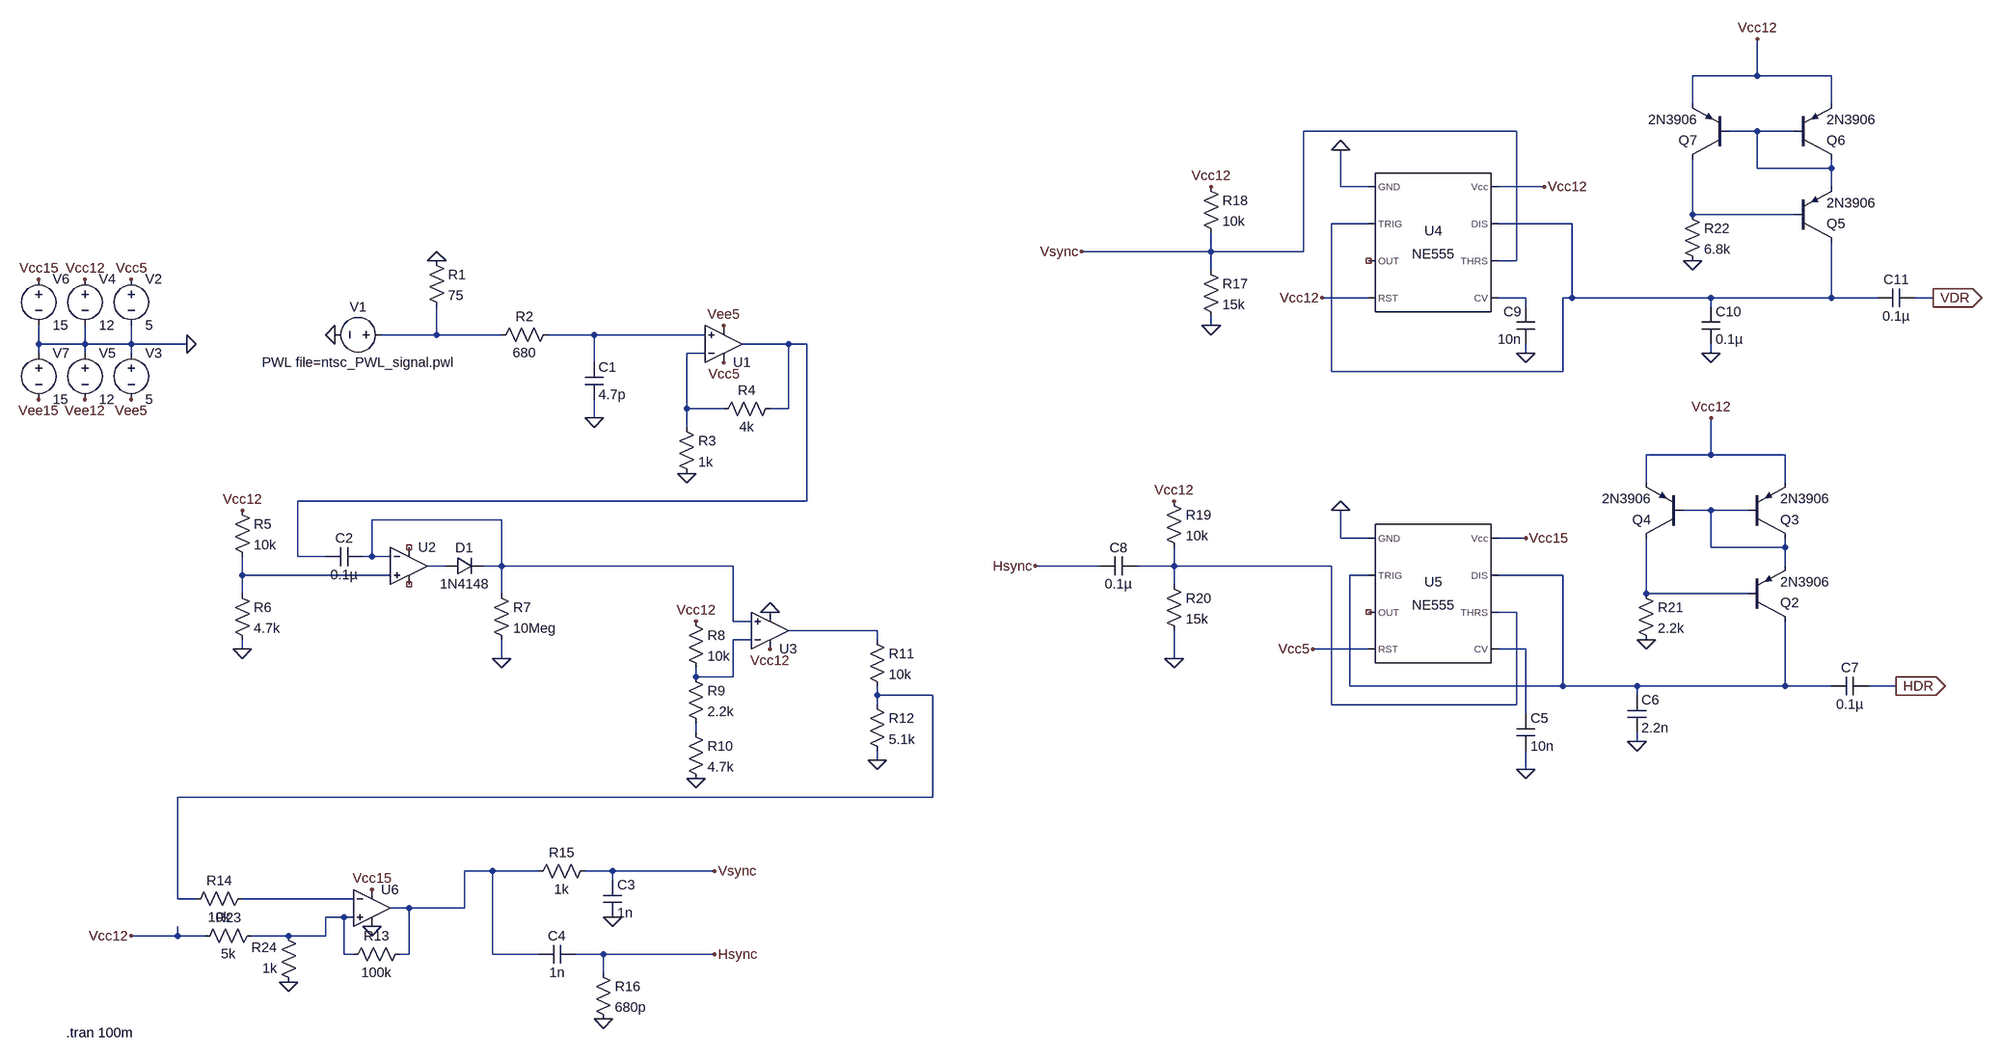
[diagram p0: schematic DocPlagueCir.asc]
DocPlagueCir.asc, the LTspice schematic file:
Version 4
SHEET 1 3116 1032
WIRE 2704 -640 2704 -704
WIRE 2704 -640 2592 -640
WIRE 2832 -640 2704 -640
WIRE 2592 -592 2592 -640
WIRE 2832 -592 2832 -640
WIRE 2288 -544 1920 -544
WIRE 2704 -544 2656 -544
WIRE 2768 -544 2704 -544
WIRE 2704 -480 2704 -544
WIRE 2832 -480 2832 -496
WIRE 2832 -480 2704 -480
WIRE 1984 -448 1984 -512
WIRE 2032 -448 1984 -448
WIRE 2336 -448 2256 -448
WIRE 2832 -448 2832 -480
WIRE 2592 -400 2592 -496
WIRE 2768 -400 2592 -400
WIRE 2032 -384 1968 -384
WIRE 2384 -384 2256 -384
WIRE 1760 -336 1760 -368
WIRE 1760 -336 1536 -336
WIRE 1920 -336 1920 -544
WIRE 1920 -336 1760 -336
WIRE 2288 -320 2288 -544
WIRE 2288 -320 2256 -320
WIRE 1760 -304 1760 -336
WIRE 2032 -256 1952 -256
WIRE 2304 -256 2256 -256
WIRE 2384 -256 2384 -384
WIRE 2384 -256 2368 -256
WIRE 2624 -256 2384 -256
WIRE 2832 -256 2832 -352
WIRE 2832 -256 2624 -256
WIRE 2912 -256 2832 -256
WIRE 3008 -256 2976 -256
WIRE 2304 -240 2304 -256
WIRE 2624 -240 2624 -256
WIRE 1760 -208 1760 -224
WIRE 160 -192 160 -240
WIRE 160 -192 64 -192
WIRE 272 -192 160 -192
WIRE 432 -192 352 -192
WIRE 624 -192 432 -192
WIRE -528 -176 -528 -208
WIRE -448 -176 -448 -208
WIRE -448 -176 -528 -176
WIRE -368 -176 -368 -208
WIRE -368 -176 -448 -176
WIRE -272 -176 -368 -176
WIRE 768 -176 688 -176
WIRE 800 -176 768 -176
WIRE -528 -160 -528 -176
WIRE -448 -160 -448 -176
WIRE -368 -160 -368 -176
WIRE 624 -160 592 -160
WIRE 2304 -160 2304 -176
WIRE 2624 -160 2624 -176
WIRE 432 -144 432 -192
WIRE 1968 -128 1968 -384
WIRE 2368 -128 2368 -256
WIRE 2368 -128 1968 -128
WIRE 592 -64 592 -160
WIRE 656 -64 592 -64
WIRE 768 -64 768 -176
WIRE 768 -64 736 -64
WIRE 432 -48 432 -80
WIRE 592 -32 592 -64
WIRE 2624 16 2624 -48
WIRE 2624 16 2512 16
WIRE 2752 16 2624 16
WIRE 2512 64 2512 16
WIRE 2752 64 2752 16
WIRE 800 96 800 -176
WIRE 800 96 -80 96
WIRE 2624 112 2576 112
WIRE 2688 112 2624 112
WIRE 272 128 48 128
WIRE 1984 160 1984 112
WIRE 2032 160 1984 160
WIRE 2304 160 2256 160
WIRE 2624 176 2624 112
WIRE 2752 176 2752 160
WIRE 2752 176 2624 176
WIRE -80 192 -80 96
WIRE -32 192 -80 192
WIRE 48 192 48 128
WIRE 48 192 32 192
WIRE 80 192 48 192
WIRE 176 208 144 208
WIRE 272 208 272 128
WIRE 272 208 240 208
WIRE 672 208 272 208
WIRE 1568 208 1456 208
WIRE 1696 208 1696 176
WIRE 1696 208 1632 208
WIRE 1968 208 1696 208
WIRE 2752 208 2752 176
WIRE -176 224 -176 192
WIRE 80 224 -176 224
WIRE 2032 224 2000 224
WIRE 2368 224 2256 224
WIRE 1696 240 1696 208
WIRE -176 256 -176 224
WIRE 272 256 272 208
WIRE 2512 256 2512 160
WIRE 2688 256 2512 256
WIRE 2288 288 2256 288
WIRE 672 304 672 208
WIRE 704 304 672 304
WIRE 928 320 768 320
WIRE 704 336 672 336
WIRE 928 336 928 320
WIRE -176 352 -176 336
WIRE 2032 352 1936 352
WIRE 2304 352 2256 352
WIRE 272 368 272 336
WIRE 1696 368 1696 320
WIRE 608 400 608 384
WIRE 672 400 672 336
WIRE 672 400 608 400
WIRE 2000 416 2000 224
WIRE 2368 416 2368 224
WIRE 2368 416 2000 416
WIRE 2496 416 2368 416
WIRE 2752 416 2752 304
WIRE 2752 416 2496 416
WIRE 2832 416 2752 416
WIRE 2944 416 2896 416
WIRE 928 432 928 416
WIRE 1024 432 928 432
WIRE 2496 432 2496 416
WIRE 928 448 928 432
WIRE 1968 448 1968 208
WIRE 2288 448 2288 288
WIRE 2288 448 1968 448
WIRE 2304 464 2304 352
WIRE 608 496 608 480
WIRE 2496 512 2496 496
WIRE 928 544 928 528
WIRE 2304 560 2304 528
WIRE 1024 608 1024 432
WIRE 1024 608 -288 608
WIRE 256 736 208 736
WIRE 336 736 256 736
WIRE 464 736 416 736
WIRE 640 736 464 736
WIRE 464 752 464 736
WIRE -288 784 -288 608
WIRE -256 784 -288 784
WIRE 16 784 -176 784
WIRE 112 800 80 800
WIRE 208 800 208 736
WIRE 208 800 112 800
WIRE 0 816 -32 816
WIRE 16 816 0 816
WIRE -288 848 -288 832
WIRE -288 848 -368 848
WIRE -240 848 -288 848
WIRE -96 848 -160 848
WIRE -32 848 -32 816
WIRE -32 848 -96 848
WIRE 0 880 0 816
WIRE 16 880 0 880
WIRE 112 880 112 800
WIRE 112 880 96 880
WIRE 256 880 256 736
WIRE 336 880 256 880
WIRE 448 880 400 880
WIRE 640 880 448 880
WIRE 448 912 448 880
FLAG -272 -176 0
FLAG -368 -80 Vee5
FLAG -368 -288 Vcc5
FLAG -16 -192 0
FLAG 160 -320 0
FLAG 432 -48 0
FLAG -448 -288 Vcc12
FLAG -448 -80 Vee12
FLAG 656 -208 Vee5
FLAG 656 -144 Vcc5
FLAG 592 48 0
FLAG -176 352 0
FLAG -176 112 Vcc12
FLAG 272 368 0
FLAG 736 288 0
FLAG 736 352 Vcc12
FLAG 608 304 Vcc12
FLAG 608 576 0
FLAG 928 544 0
FLAG 464 816 0
FLAG 640 736 Vsync
FLAG 448 992 0
FLAG 640 880 Hsync
FLAG 1760 -208 0
FLAG 1760 -448 Vcc12
FLAG 1696 96 Vcc12
FLAG 1696 368 0
FLAG 1984 112 0
FLAG -528 -288 Vcc15
FLAG -528 -80 Vee15
FLAG 2304 160 Vcc15
FLAG 1936 352 Vcc5
FLAG 2304 560 0
FLAG 2496 512 0
FLAG 2512 336 0
FLAG 2624 -48 Vcc12
FLAG 2944 416 HDR
IOPIN 2944 416 Out
FLAG 2336 -448 Vcc12
FLAG 1984 -512 0
FLAG 2304 -160 0
FLAG 1952 -256 Vcc12
FLAG 2592 -320 0
FLAG 2704 -704 Vcc12
FLAG 2624 -160 0
FLAG 3008 -256 VDR
IOPIN 3008 -256 Out
FLAG 48 832 0
FLAG 48 768 Vcc15
FLAG -368 848 Vcc12
FLAG -96 928 0
FLAG 1536 -336 Vsync
FLAG 1456 208 Hsync
SYMBOL voltage -368 -304 R0
SYMATTR InstName V2
SYMATTR Value 5
SYMBOL voltage -368 -176 R0
SYMATTR InstName V3
SYMATTR Value 5
SYMBOL voltage 80 -192 R90
WINDOW 0 -32 56 VBottom 2
WINDOW 3 32 56 VTop 2
WINDOW 123 0 0 Left 0
WINDOW 39 0 0 Left 0
SYMATTR InstName V1
SYMATTR Value PWL file=ntsc_PWL_signal.pwl
SYMBOL res 144 -336 R0
SYMATTR InstName R1
SYMATTR Value 75
SYMBOL res 368 -208 R90
WINDOW 0 0 56 VBottom 2
WINDOW 3 32 56 VTop 2
SYMATTR InstName R2
SYMATTR Value 680
SYMBOL cap 416 -144 R0
SYMATTR InstName C1
SYMATTR Value 4.7p
SYMBOL OpAmps\\UniversalOpAmp2 656 -176 M180
SYMATTR InstName U1
SYMBOL voltage -448 -304 R0
SYMATTR InstName V4
SYMATTR Value 12
SYMBOL voltage -448 -176 R0
SYMATTR InstName V5
SYMATTR Value 12
SYMBOL res 576 -48 R0
SYMATTR InstName R3
SYMATTR Value 1k
SYMBOL res 752 -80 R90
WINDOW 0 0 56 VBottom 2
WINDOW 3 32 56 VTop 2
SYMATTR InstName R4
SYMATTR Value 4k
SYMBOL cap 32 176 R90
WINDOW 0 0 32 VBottom 2
WINDOW 3 32 32 VTop 2
SYMATTR InstName C2
SYMATTR Value 0.1µ
SYMBOL OpAmps\\UniversalOpAmp2 112 208 R0
SYMATTR InstName U2
SYMBOL res -192 96 R0
SYMATTR InstName R5
SYMATTR Value 10k
SYMBOL res -192 240 R0
SYMATTR InstName R6
SYMATTR Value 4.7k
SYMBOL diode 176 224 R270
WINDOW 0 32 32 VTop 2
WINDOW 3 0 32 VBottom 2
SYMATTR InstName D1
SYMATTR Value 1N4148
SYMBOL res 256 240 R0
SYMATTR InstName R7
SYMATTR Value 10Meg
SYMBOL OpAmps\\UniversalOpAmp2 736 320 M180
SYMATTR InstName U3
SYMBOL res 592 288 R0
SYMATTR InstName R8
SYMATTR Value 10k
SYMBOL res 592 384 R0
SYMATTR InstName R9
SYMATTR Value 2.2k
SYMBOL res 592 480 R0
SYMATTR InstName R10
SYMATTR Value 4.7k
SYMBOL res 912 320 R0
SYMATTR InstName R11
SYMATTR Value 10k
SYMBOL res 912 432 R0
SYMATTR InstName R12
SYMATTR Value 5.1k
SYMBOL res -160 768 R90
WINDOW 0 0 56 VBottom 2
WINDOW 3 32 56 VTop 2
SYMATTR InstName R14
SYMATTR Value 10k
SYMBOL res 432 720 R90
WINDOW 0 0 56 VBottom 2
WINDOW 3 32 56 VTop 2
SYMATTR InstName R15
SYMATTR Value 1k
SYMBOL cap 448 752 R0
SYMATTR InstName C3
SYMATTR Value 1n
SYMBOL cap 400 864 R90
WINDOW 0 0 32 VBottom 2
WINDOW 3 32 32 VTop 2
SYMATTR InstName C4
SYMATTR Value 1n
SYMBOL res 432 896 R0
SYMATTR InstName R16
SYMATTR Value 680p
SYMBOL res 1744 -320 R0
SYMATTR InstName R17
SYMATTR Value 15k
SYMBOL res 1744 -464 R0
SYMATTR InstName R18
SYMATTR Value 10k
SYMBOL Misc\\NE555 2144 -352 R0
SYMATTR InstName U4
SYMBOL Misc\\NE555 2144 256 R0
SYMATTR InstName U5
SYMBOL res 1680 80 R0
SYMATTR InstName R19
SYMATTR Value 10k
SYMBOL res 1680 224 R0
SYMATTR InstName R20
SYMATTR Value 15k
SYMBOL voltage -528 -304 R0
WINDOW 123 0 0 Left 0
WINDOW 39 0 0 Left 0
SYMATTR InstName V6
SYMATTR Value 15
SYMBOL voltage -528 -176 R0
SYMATTR InstName V7
SYMATTR Value 15
SYMBOL cap 2288 464 R0
SYMATTR InstName C5
SYMATTR Value 10n
SYMBOL cap 2480 432 R0
SYMATTR InstName C6
SYMATTR Value 2.2n
SYMBOL cap 2896 400 R90
WINDOW 0 0 32 VBottom 2
WINDOW 3 32 32 VTop 2
SYMATTR InstName C7
SYMATTR Value 0.1µ
SYMBOL pnp 2688 304 M180
SYMATTR InstName Q2
SYMATTR Value 2N3906
SYMBOL pnp 2688 160 M180
SYMATTR InstName Q3
SYMATTR Value 2N3906
SYMBOL pnp 2576 160 R180
SYMATTR InstName Q4
SYMATTR Value 2N3906
SYMBOL res 2496 240 R0
SYMATTR InstName R21
SYMATTR Value 2.2k
SYMBOL cap 1632 192 R90
WINDOW 0 0 32 VBottom 2
WINDOW 3 32 32 VTop 2
SYMATTR InstName C8
SYMATTR Value 0.1µ
SYMBOL cap 2320 -176 R180
WINDOW 0 24 56 Left 2
WINDOW 3 24 8 Left 2
SYMATTR InstName C9
SYMATTR Value 10n
SYMBOL pnp 2768 -352 M180
SYMATTR InstName Q5
SYMATTR Value 2N3906
SYMBOL pnp 2768 -496 M180
SYMATTR InstName Q6
SYMATTR Value 2N3906
SYMBOL pnp 2656 -496 R180
SYMATTR InstName Q7
SYMATTR Value 2N3906
SYMBOL res 2576 -416 R0
SYMATTR InstName R22
SYMATTR Value 6.8k
SYMBOL cap 2608 -240 R0
SYMATTR InstName C10
SYMATTR Value 0.1µ
SYMBOL cap 2976 -272 R90
WINDOW 0 0 32 VBottom 2
WINDOW 3 32 32 VTop 2
SYMATTR InstName C11
SYMATTR Value 0.1µ
SYMBOL OpAmps\\UniversalOpAmp2 48 800 R0
SYMATTR InstName U6
SYMBOL res 112 864 R90
WINDOW 0 0 56 VBottom 2
WINDOW 3 32 56 VTop 2
SYMATTR InstName R13
SYMATTR Value 100k
SYMBOL res -144 832 R90
WINDOW 0 0 56 VBottom 2
WINDOW 3 32 56 VTop 2
SYMATTR InstName R23
SYMATTR Value 5k
SYMBOL res -80 944 R180
WINDOW 0 36 76 Left 2
WINDOW 3 36 40 Left 2
SYMATTR InstName R24
SYMATTR Value 1k
TEXT -480 1016 Left 2 !.tran 100m

The netlist it stands for:
* DocPlagueCir.asc
V2 Vcc5 0 5
V3 0 Vee5 5
V1 N005 0 PWL file=ntsc_PWL_signal.pwl
R1 0 N005 75
R2 N006 N005 680
C1 N006 0 4.7p
XU1 N006 N008 Vcc5 Vee5 N007 level2 Avol=1Meg GBW=10Meg Slew=10Meg Ilimit=25m Rail=0 Vos=0 En=0 Enk=0 In=0 Ink=0 Rin=500Meg  ; pins In+ In- V+ V- OUT
V4 Vcc12 0 12
V5 0 Vee12 12
R3 N008 0 1k
R4 N007 N008 4k
C2 N010 N007 0.1µ
XU2 N013 N010 NC_01 NC_02 N011 level2 Avol=1Meg GBW=10Meg Slew=10Meg Ilimit=25m Rail=0 Vos=0 En=0 Enk=0 In=0 Ink=0 Rin=500Meg  ; pins In+ In- V+ V- OUT
R5 Vcc12 N013 10k
R6 N013 0 4.7k
D1 N011 N010 1N4148
R7 N010 0 10Meg
XU3 N010 N017 Vcc12 0 N016 level2 Avol=1Meg GBW=10Meg Slew=10Meg Ilimit=25m Rail=0 Vos=0 En=0 Enk=0 In=0 Ink=0 Rin=500Meg  ; pins In+ In- V+ V- OUT
R8 Vcc12 N017 10k
R9 N017 N020 2.2k
R10 N020 0 4.7k
R11 N016 N019 10k
R12 N019 0 5.1k
R14 N022 N019 10k
R15 Vsync N021 1k
C3 Vsync 0 1n
C4 Hsync N021 1n
R16 Hsync 0 680p
R17 Vsync 0 15k
R18 Vcc12 Vsync 10k
XU4 0 N003 NC_03 Vcc12 N004 Vsync N003 Vcc12 NE555  ; pins GND TRIG OUT RST CV THRS DIS Vcc
XU5 0 N014 NC_04 Vcc5 N018 N012 N014 Vcc15 NE555  ; pins GND TRIG OUT RST CV THRS DIS Vcc
R19 Vcc12 N012 10k
R20 N012 0 15k
V6 Vcc15 0 15
V7 0 Vee15 15
C5 N018 0 10n
C6 N014 0 2.2n
C7 HDR N014 0.1µ
Q2 N014 N015 N009 0 2N3906
Q3 N009 N009 Vcc12 0 2N3906
Q4 N015 N009 Vcc12 0 2N3906
R21 N015 0 2.2k
C8 N012 Hsync 0.1µ
C9 0 N004 10n
Q5 N003 N002 N001 0 2N3906
Q6 N001 N001 Vcc12 0 2N3906
Q7 N002 N001 Vcc12 0 2N3906
R22 N002 0 6.8k
C10 N003 0 0.1µ
C11 VDR N003 0.1µ
XU6 N023 N022 Vcc15 0 N021 level2 Avol=1Meg GBW=10Meg Slew=10Meg Ilimit=25m Rail=0 Vos=0 En=0 Enk=0 In=0 Ink=0 Rin=500Meg  ; pins In+ In- V+ V- OUT
R13 N021 N023 100k
R23 N023 Vcc12 5k
R24 0 N023 1k
.model D D
.lib standard.dio
.model NPN NPN
.model PNP PNP
.lib standard.bjt
.tran 100m
.lib UniversalOpAmp2.lib
.lib NE555.sub
.backanno
.end